# EAGLE design Arduino LCD Clock rev 1 (EAGLE 6.3)
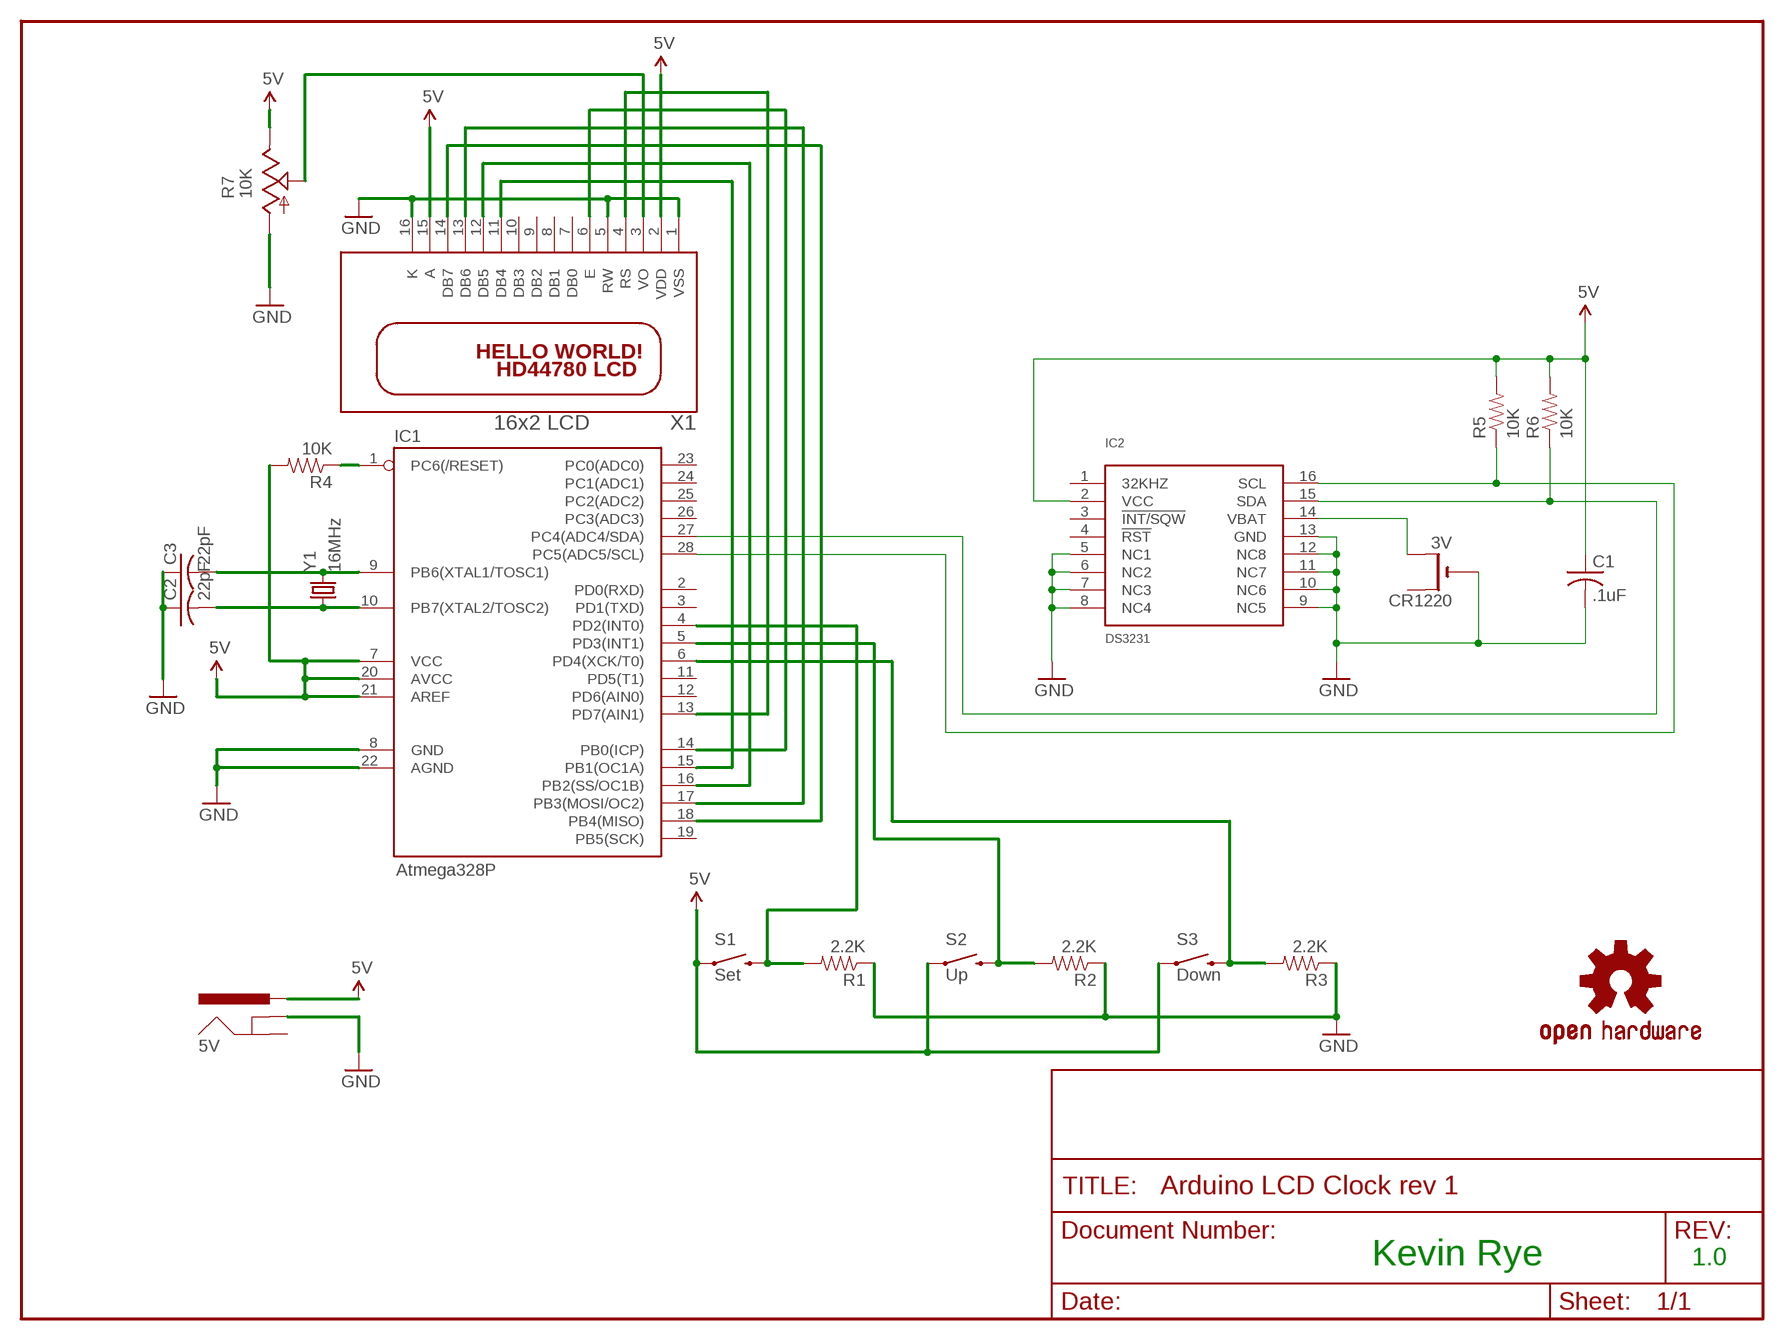
[diagram p0: schematic, sheet 1]

## Parts
5V  POWER_JACKSLT  [POWER_JACK_SLOT]
C1  .1uF  C-US025-024X044  [C025-024X044]
C2  22pF  C-US025-024X044  [C025-024X044]
C3  22pF  C-US025-024X044  [C025-024X044]
CR1220  3V  CR1220THM  [CR1220-THM]
IC1  Atmega328P  AVR-MEGA8-PPTH  [DIL28-3]
IC2  DS3231  DS3231SN  [SO16W]
R1  2.2K  RESISTORPTH-1/4W  [AXIAL-0.4]
R2  2.2K  RESISTORPTH-1/4W  [AXIAL-0.4]
R3  2.2K  RESISTORPTH-1/4W  [AXIAL-0.4]
R4  10K  RESISTORPTH-1/4W  [AXIAL-0.4]
R5  10K  RESISTORPTH-1/4W  [AXIAL-0.4]
R6  10K  RESISTORPTH-1/4W  [AXIAL-0.4]
R7  10K  TRIM_US-S63S  [S63S]
S1  Set  SWITCH-MOMENTARY-212MM  [TACTILE-PTH-12MM]
S2  Up  SWITCH-MOMENTARY-212MM  [TACTILE-PTH-12MM]
S3  Down  SWITCH-MOMENTARY-212MM  [TACTILE-PTH-12MM]
U$2  OSHW-LOGOM  [OSHW-LOGO-M]
X1  16x2 LCD  HD44780LCD-1602  [LCD1602]
Y1  16MHz  CRYSTALHC49US  [HC49US]

## Nets
5V: 5V.PWR C1.1 IC1.7(VCC) IC1.20(AVCC) IC1.21(AREF) IC2.2(VCC) R4.P$2 R5.P$2 R6.P$2 R7.E S1.1 S2.1 S3.1 X1.2(VDD) X1.15(A)
GND: 5V.GND@1(GNDBREAK) C1.2 C2.1 C3.1 CR1220.- IC1.8(GND) IC1.22(AGND) IC2.5(NC1) IC2.6(NC2) IC2.7(NC3) IC2.8(NC4) IC2.9(NC5) IC2.10(NC6) IC2.11(NC7) IC2.12(NC8) IC2.13(GND) R1.P$1 R2.P$1 R3.P$1 R7.A X1.1(VSS) X1.5(RW) X1.16(K)
N$1: CR1220.+2(+1) IC2.14(VBAT)
N$4: IC1.18(PB4(MISO)) X1.14(DB7)
N$5: IC1.17(PB3(MOSI/OC2)) X1.13(DB6)
N$6: IC1.28(PC5(ADC5/SCL)) IC2.16(SCL) R5.P$1
N$8: IC1.13(PD7(AIN1)) X1.4(RS)
N$9: C3.2 IC1.9(PB6(XTAL1/TOSC1)) Y1.2
N$10: C2.2 IC1.10(PB7(XTAL2/TOSC2)) Y1.1
N$11: IC1.1(PC6(/RESET)) R4.P$1
N$13: R7.S X1.3(VO)
N$14: IC1.14(PB0(ICP)) X1.6(E)
N$15: IC1.16(PB2(SS/OC1B)) X1.12(DB5)
N$16: IC1.15(PB1(OC1A)) X1.11(DB4)
N$17: IC1.5(PD3(INT1)) R2.P$2 S2.3
N$18: IC1.27(PC4(ADC4/SDA)) IC2.15(SDA) R6.P$1
N$21: IC1.4(PD2(INT0)) R1.P$2 S1.3
N$23: IC1.6(PD4(XCK/T0)) R3.P$2 S3.3
Unconnected: 5V.GND@2(GND) CR1220.+1(+) IC1.2(PD0(RXD)) IC1.3(PD1(TXD)) IC1.11(PD5(T1)) IC1.12(PD6(AIN0)) IC1.19(PB5(SCK)) IC1.23(PC0(ADC0)) IC1.24(PC1(ADC1)) IC1.25(PC2(ADC2)) IC1.26(PC3(ADC3)) IC2.1(32KHZ) IC2.3(!INT/SQW) IC2.4(!RST) X1.7(DB0) X1.8(DB1) X1.9(DB2) X1.10(DB3)

## Notes on the sheet
- Kevin Rye | 1.0

## Library data of the parts
5V = SparkFun:POWER_JACK: Power Jack This is the standard 5.5mm barrel jack for power. The PTH is the most common, proven, reliable, footprint. All others are experimental. The Slot footprint only works if the mill layer is transmitted to the PCB fab house so be warned. Spark Fun Electronics SKU : PRT-00119. Mating wall wart : TOL-00298 (and others)
C1-C3 = adafruit:C-US: CAPACITOR, American symbol
CR1220 = adafruit:CR1220: CR1216/CR1220/CR1225 12mm 3V lithium coin cell Great for battery packup. Both SMT and THM holders. Note the THM package has the ground pads on both sides of the PCB so that the masks are the same - this reduces the cost
IC1 = SparkFun:AVR-MEGA8-P: MICROCONTROLLER 8 Kbytes FLASH 1 kbytes SRAM 512 bytes EEPROM USART 4-channel 10 bit ADC 2-channel 8 bit ADC
IC2 = comfile:DS3231SN
R1-R6 = SparkFun:RESISTOR: Resistor Basic schematic elements and footprints for 0603, 1206, and PTH resistors.
R7 = pot:TRIM_US-: POTENTIOMETER
S1-S3 = SparkFun:SWITCH-MOMENTARY-2
U$2 = SparkFun:OSHW-LOGO: Open Source Hardware Logo This logo indicates the piece of hardware it is found on incorporates a OSHW license and/or adheres to the definition of open source hardware found here: http://freedomdefined.org/OSHW
X1 = adafruit:HD44780LCD: HD44780 LCD Standard character type LCDs, available in sizes from 8x1 to 40x4!
Y1 = SparkFun:CRYSTAL: Crystals Various standard crystals. Proven footprints. Spark Fun Electronics SKU : COM-00534

## Board
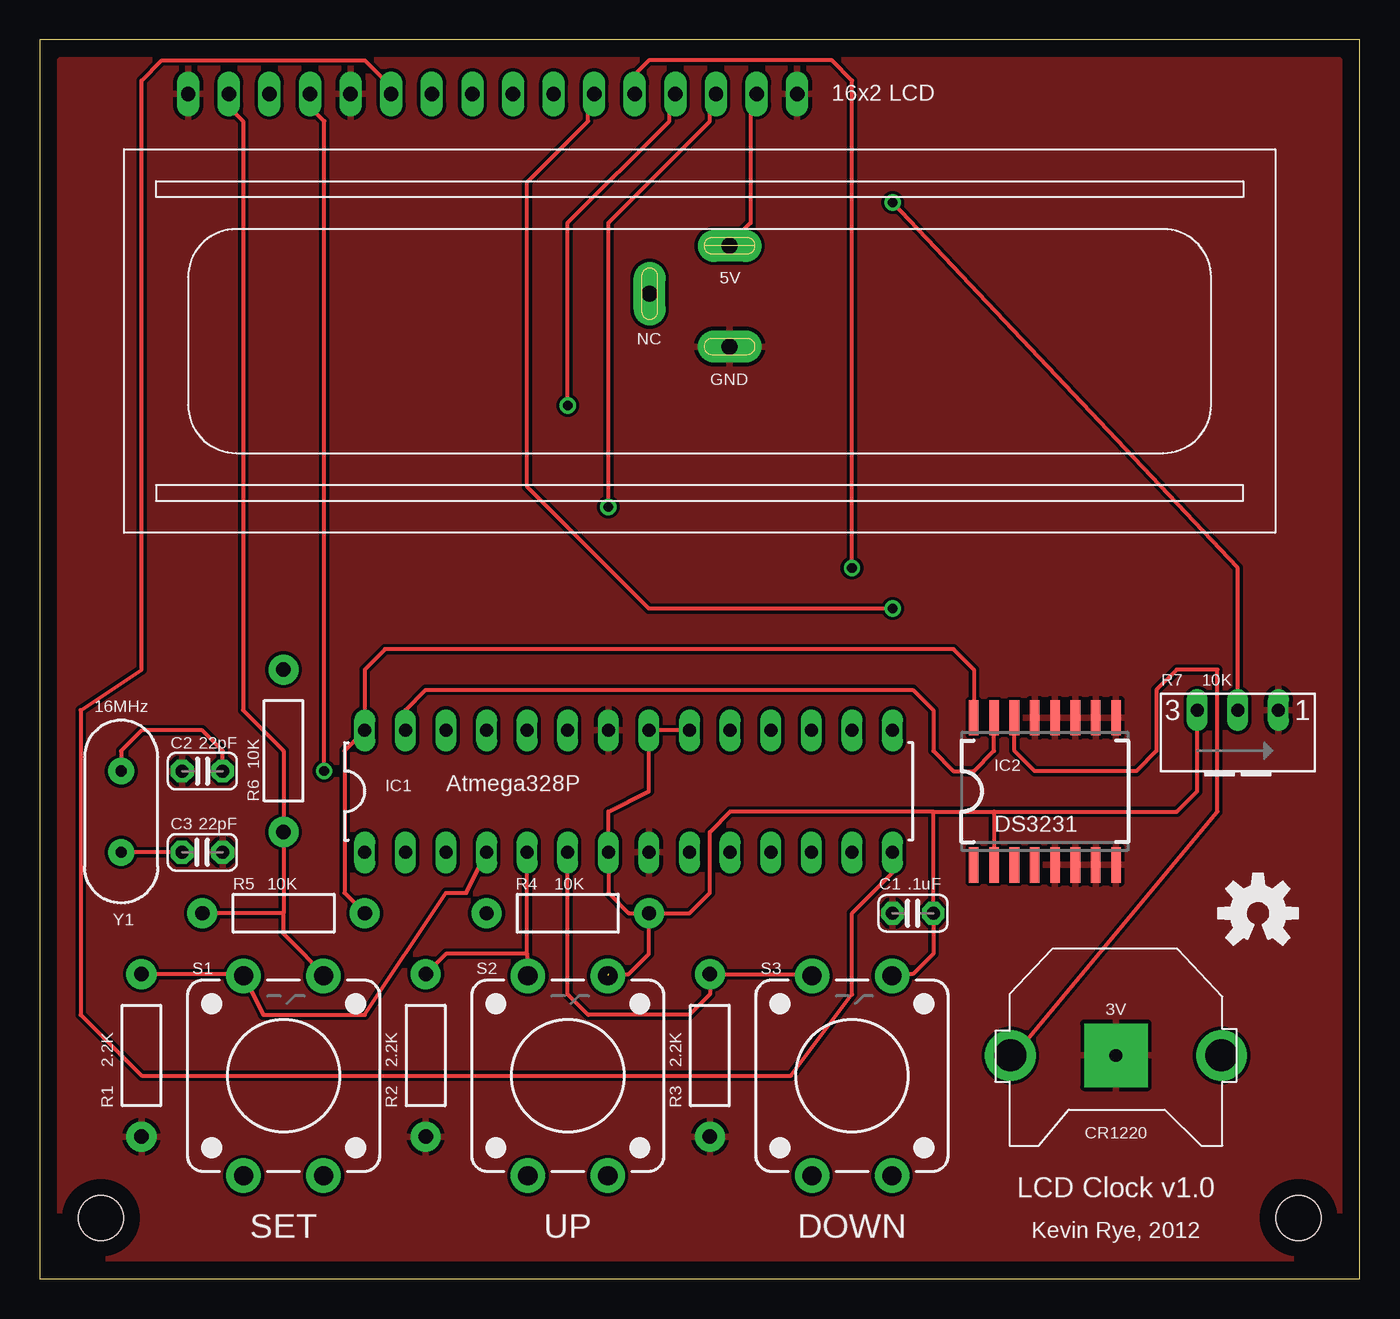
[diagram p1: board, top side]
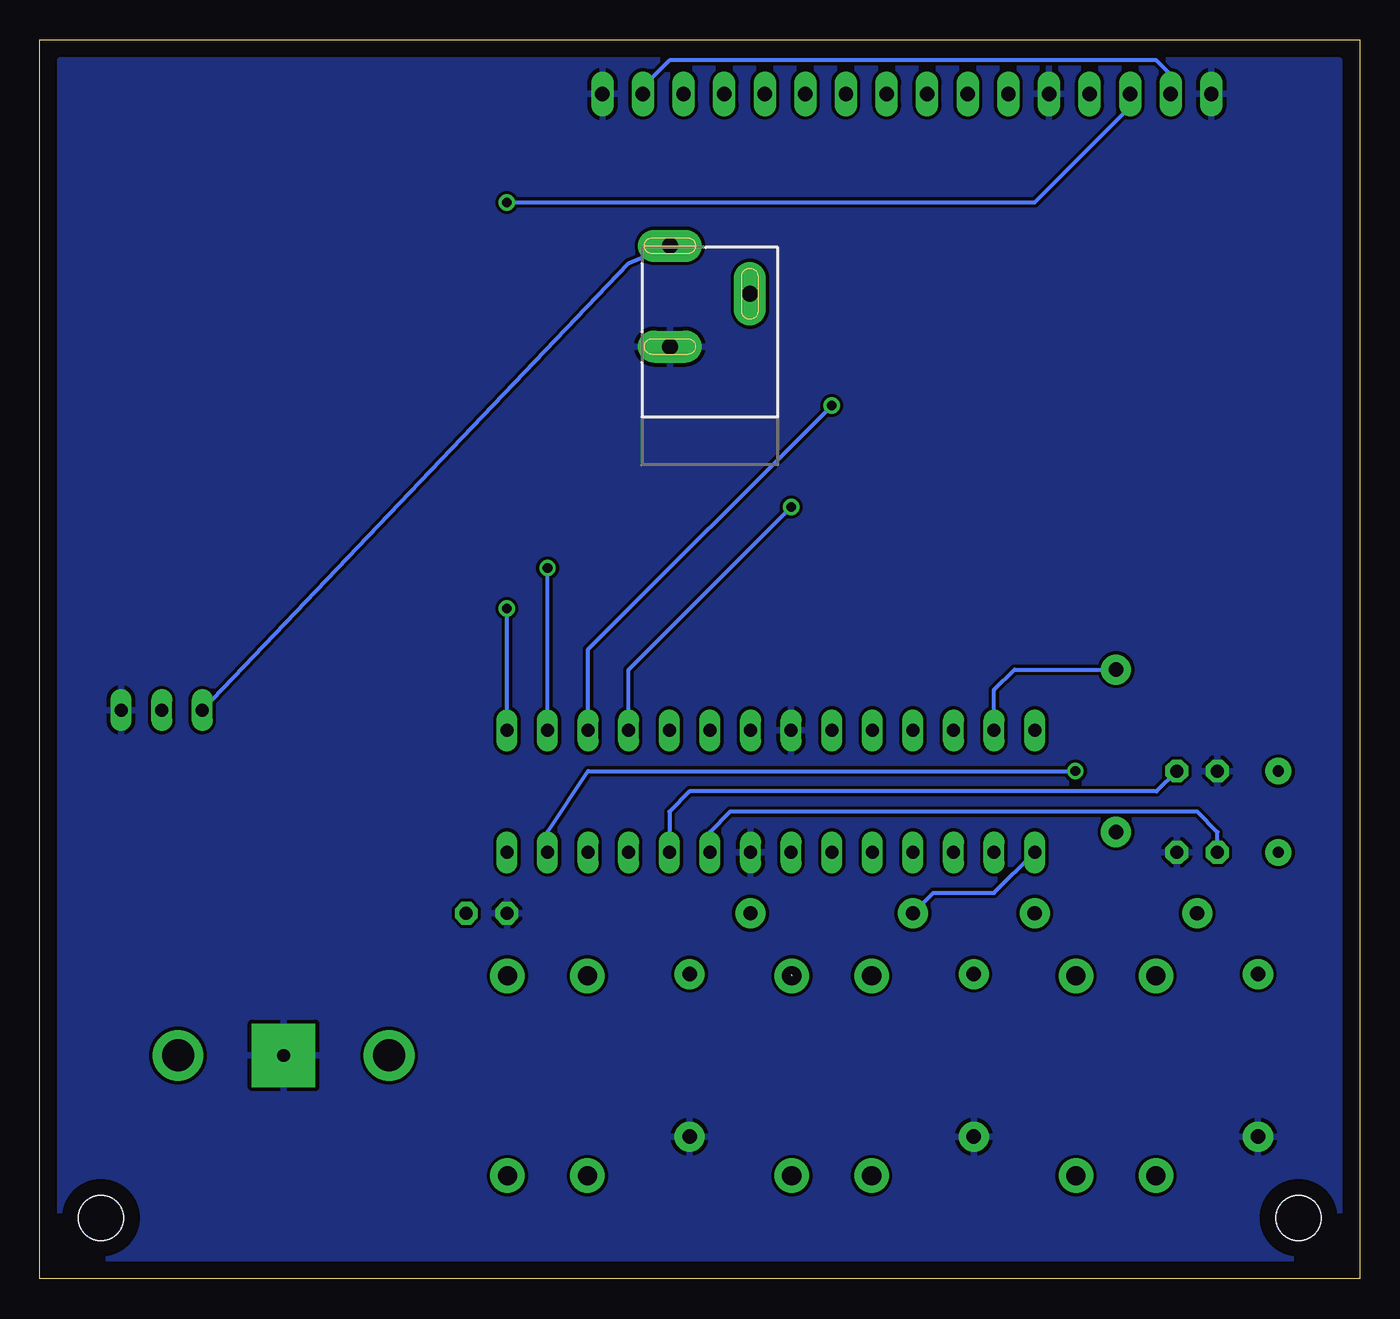
[diagram p2: board, bottom side, seen from below]

Size 82.55 x 77.47 mm. Coordinates in mm from the lower left corner, seen from the top.
Outline: 0,77.47 0,0 82.55,0 82.55,77.47 0,77.47
Copper layers (1*16): Top 0.035mm / dielectric 1.5mm / Bottom 0.035mm
Design rules "default": minimum track width 10mil, minimum drill 24mil, track to track 8mil, track to pad 8mil, pad to pad 8mil, via to via 8mil, smd to smd 8mil, copper to edge 40mil, drill to drill 8mil, minimum pad ring 10mil, minimum via ring 8mil, stop-mask expansion 4mil, vias tented up to drill 0mil, thermal gap 10mil
Holes 2.8 mm at 3.81,3.81 78.74,3.81

### Footprints (pad centres in the part's own frame; a part is rotated, then mirrored left to right if it is on the bottom)
POWER_JACK_SLOT = drill 1 pad 2 long: GND@1 2.58,7.5; GND@2 7.58,10.8; PWR 2.58,13.8
C025-024X044 = drill 0.813 pad 1.422 octagon: 1 -1.27,0; 2 1.27,0
CR1220-THM = drill 2 pad 3.175: +1 -6.604,0; +2 6.604,0 | drill 0.8 pad 3.962 square: - 0,0
DIL28-3 = drill 0.813 long: 1 -16.51,-3.81; 2 -13.97,-3.81; 3 -11.43,-3.81; 4 -8.89,-3.81; 5 -6.35,-3.81; 6 -3.81,-3.81; 7 -1.27,-3.81; 8 1.27,-3.81; 9 3.81,-3.81; 10 6.35,-3.81; 11 8.89,-3.81; 12 11.43,-3.81; 13 13.97,-3.81; 14 16.51,-3.81; 15 16.51,3.81; 16 13.97,3.81; 17 11.43,3.81; 18 8.89,3.81; 19 6.35,3.81; 20 3.81,3.81; 21 1.27,3.81; 22 -1.27,3.81; 23 -3.81,3.81; 24 -6.35,3.81; 25 -8.89,3.81; 26 -11.43,3.81; 27 -13.97,3.81; 28 -16.51,3.81
SO16W = smd 0.6 x 2.2: 1 -4.445,-4.6; 2 -3.175,-4.6; 3 -1.905,-4.6; 4 -0.635,-4.6; 5 0.635,-4.6; 6 1.905,-4.6; 7 3.175,-4.6; 8 4.445,-4.6; 9 4.445,4.6; 10 3.175,4.6; 11 1.905,4.6; 12 0.635,4.6; 13 -0.635,4.6; 14 -1.905,4.6; 15 -3.175,4.6; 16 -4.445,4.6
AXIAL-0.4 = drill 0.9 pad 1.88: P$1 -5.08,0; P$2 5.08,0
S63S = drill 0.813 long: A 2.54,1.27; E -2.54,1.27; S 0,1.27
TACTILE-PTH-12MM = drill 1.2 pad 2.159: 1 6.25,-2.5; 2 -6.25,-2.5; 3 6.25,2.5; 4 -6.25,2.5
LCD1602 = drill 0.9 long: 1 8,33.46; 2 10.54,33.46; 3 13.08,33.46; 4 15.62,33.46; 5 18.16,33.46; 6 20.7,33.46; 7 23.24,33.46; 8 25.78,33.46; 9 28.32,33.46; 10 30.86,33.46; 11 33.4,33.46; 12 35.94,33.46; 13 38.48,33.46; 14 41.02,33.46; 15 43.56,33.46; 16 46.1,33.46
HC49US = drill 0.7 pad 1.651: 1 -2.54,0; 2 2.54,0

### Placement (x,y rotation side)
5V  45.72,50.8 0 bottom
C1  54.61,22.86 180 top
C2  10.16,31.75 0 top
C3  10.16,26.67 180 top
CR1220  67.31,13.97 180 top
IC1  36.83,30.48 0 top
IC2  62.87,30.48 0 top
R1  6.35,13.97 90 top
R2  24.13,13.97 90 top
R3  41.91,13.97 90 top
R4  33.02,22.86 0 top
R5  15.24,22.86 180 top
R6  15.24,33.02 270 top
R7  74.93,34.29 0 top
S1  15.24,12.7 90 top
S2  33.02,12.7 90 top
S3  50.8,12.7 90 top
U$2  76.2,22.86 0 top
X1  1.27,40.64 0 top
Y1  5.08,29.21 270 top

### Tracks (layer width: path | path; a pad name or v marks a point on that pad's centre or on a via)
5V  (1 unrouted)
  Top 0.254: X1.2 11.43,73.66 12.7,72.39 12.7,35.56 15.24,33.02 R6.P$2 15.24,22.86 | 5V.PWR 43.18,64.77 44.45,66.04 44.45,73.66 X1.15 | 15.24,22.86 15.24,21.59 16.51,20.32 S1.1 | 15.24,22.86 R5.P$2 | 59.69,29.21 IC2.2 | 55.88,29.21 59.69,29.21 | 55.88,29.21 C1.1 55.88,20.32 54.61,19.05 53.34,19.05 S3.1 | 59.69,29.21 71.12,29.21 72.39,30.48 R7.E | R4.P$2 40.64,22.86 41.91,24.13 41.91,27.94 43.18,29.21 55.88,29.21 | IC1.20 IC1.21 38.1,30.48 35.56,29.21 IC1.7 35.56,24.13 36.83,22.86 R4.P$2 | 35.56,19.05 36.83,19.05 38.1,20.32 R4.P$2
  Bottom 0.254: X1.15 44.45,74.93 43.18,76.2 12.7,76.2 11.43,74.93 X1.2 11.43,73.66 | R7.E 45.72,63.5 5V.PWR
GND
  pour Bottom: 1.27,76.2 1.27,1.27 81.28,1.27 81.28,76.2
  pour Top: 81.28,76.2 81.28,1.27 1.27,1.27 1.27,76.2
N$1
  Top 0.254: IC2.14 60.96,33.02 62.23,31.75 68.58,31.75 69.85,33.02 69.85,36.83 71.12,38.1 73.66,38.1 73.66,29.21 60.96,13.97 CR1220.+2
N$4  (via drill 0.61)
  Top 0.254: v35.56,48.26 35.56,66.04 41.91,72.39 41.91,73.66 X1.14
  Bottom 0.254: v35.56,48.26 45.72,38.1 IC1.18
N$5  (via drill 0.61)
  Top 0.254: v33.02,54.61 33.02,66.04 39.37,72.39 39.37,73.66 X1.13
  Bottom 0.254: v33.02,54.61 48.26,39.37 IC1.17
N$6
  Top 0.254: IC2.16 58.42,38.1 57.15,39.37 21.59,39.37 20.32,38.1 IC1.28 19.05,33.02 19.05,24.13 R5.P$1
N$8  (via drill 0.61)
  Top 0.254: v17.78,31.75 17.78,72.39 16.51,73.66 X1.4
  Bottom 0.254: v17.78,31.75 48.26,31.75 50.8,27.94 IC1.13
N$9
  Top 0.254: C3.2 Y1.2
  Bottom 0.254: IC1.9 40.64,27.94 39.37,29.21 10.16,29.21 8.89,27.94 C3.2
N$10
  Top 0.254: C2.2 11.43,33.02 10.16,34.29 6.35,34.29 5.08,33.02 Y1.1
  Bottom 0.254: IC1.10 43.18,29.21 41.91,30.48 12.7,30.48 C2.2
N$11
  Bottom 0.254: IC1.1 22.86,24.13 26.67,24.13 R4.P$1
N$13  (via drill 0.61)
  Top 0.254: v53.34,67.31 74.93,44.45 R7.S
  Bottom 0.254: v53.34,67.31 20.32,67.31 13.97,73.66 X1.3
N$14
  Top 0.254: X1.6 21.59,74.93 20.32,76.2 7.62,76.2 6.35,74.93 6.35,38.1 2.54,35.56 2.54,16.51 6.35,12.7 46.99,12.7 50.8,17.78 50.8,22.86 53.34,25.4 IC1.14
N$15  (via drill 0.61)
  Top 0.254: v50.8,44.45 50.8,74.93 49.53,76.2 38.1,76.2 36.83,74.93 X1.12
  Bottom 0.254: IC1.16 v50.8,44.45
N$16  (via drill 0.61)
  Top 0.254: v53.34,41.91 38.1,41.91 30.48,49.53 30.48,68.58 34.29,72.39 34.29,73.66 X1.11
  Bottom 0.254: IC1.15 v53.34,41.91
N$17
  Top 0.254: 30.48,20.32 25.4,20.32 R2.P$2 | 30.48,20.32 S2.3 | 30.48,20.32 IC1.5
N$18
  Top 0.254: IC2.15 59.69,33.02 58.42,31.75 57.15,31.75 55.88,33.02 55.88,35.56 54.61,36.83 24.13,36.83 22.86,35.56 IC1.27
  Bottom 0.254: R6.P$1 21.59,38.1 22.86,36.83 IC1.27
N$21
  Top 0.254: IC1.4 26.67,24.13 25.4,24.13 20.32,16.51 13.97,16.51 12.7,19.05 | 12.7,19.05 R1.P$2 | 12.7,19.05 S1.3
N$23
  Top 0.254: IC1.6 33.02,17.78 34.29,16.51 40.64,16.51 41.91,17.78 R3.P$2 48.26,19.05 S3.3

### Text on the board
tNames: 16x2 LCD | NC | GND | S1 | S2 | S3 | LCD Clock v1.0 | SET | UP | DOWN | Kevin Rye, 2012